# EAGLE design OSO-RING-B1-01 (EAGLE 9.6.2)
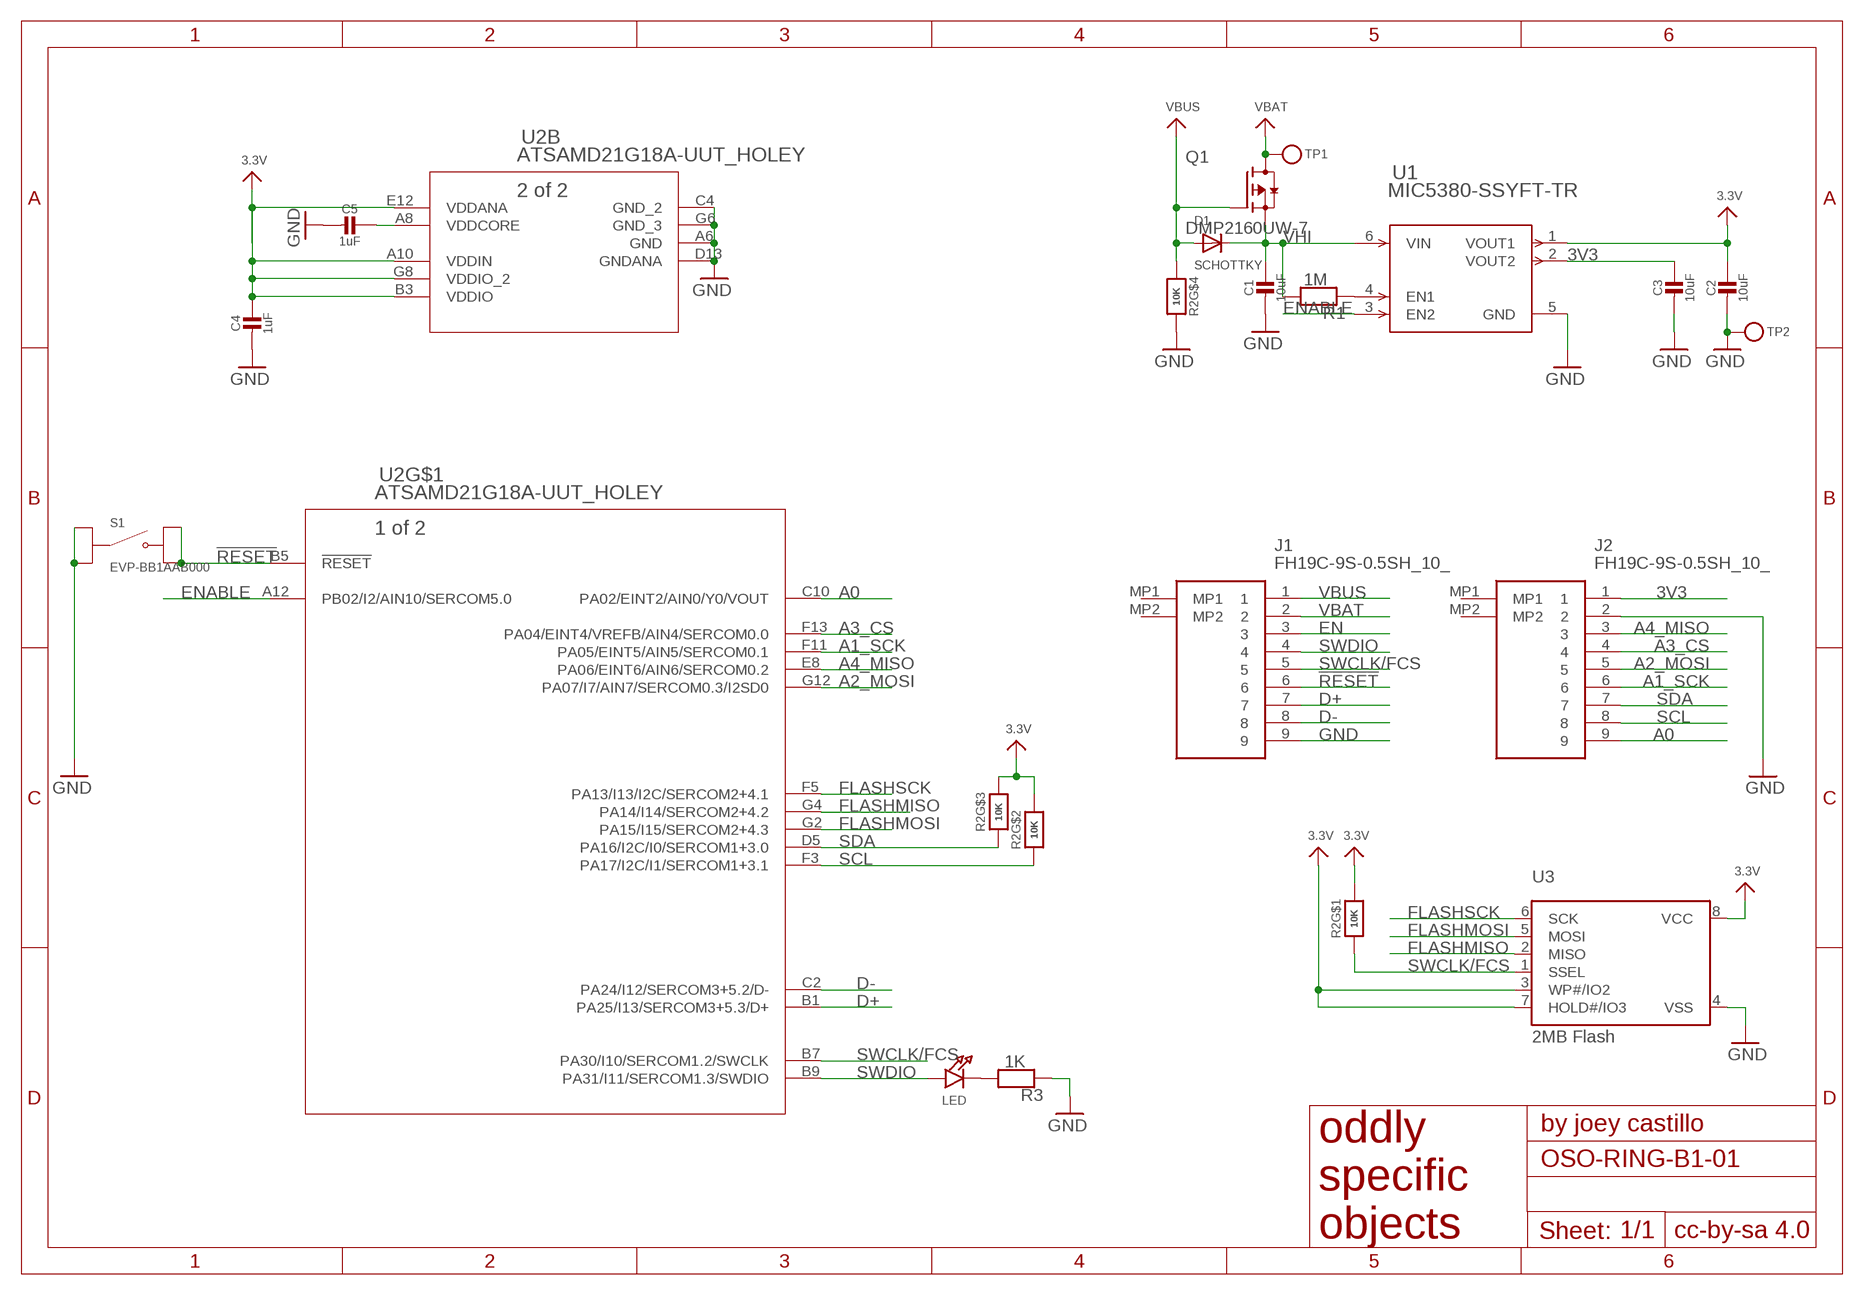
[diagram p0: schematic, sheet 1]

## Parts
C1  10uF  CAP_CERAMIC_0603MP  [_0603MP]
C2  10uF  CAP_CERAMIC_0603MP  [_0603MP]
C3  10uF  CAP_CERAMIC_0603MP  [_0603MP]
C4  1uF  CAP_CERAMIC_0603MP  [_0603MP]
C5  1uF  CAP_CERAMIC_0603MP  [_0603MP]
D1  SCHOTTKY  DIODESOD-323F  [SOD-323F]
J1  FH19C-9S-0.5SH_10_  [FH19C9S05SH10]
J2  FH19C-9S-0.5SH_10_  [FH19C9S05SH10]
LED  LED0603_NOOUTLINE  [CHIPLED_0603_NOOUTLINE]
Q1  DMP2160UW-7  [SOT65P210X110-3N]
R1  1M  RESISTOR_0603MP  [_0603MP]
R2  10K  EXB-V8V103JV-GOOD  [EXBV8V]
R3  1K  RESISTOR_0603MP  [_0603MP]
S1  EVP-BB1AAB000  [SW_EVP-BB1AAB000]
TP1  TESTPOINTROUND1.5MM  [TESTPOINT_ROUND_1.5MM]
TP2  TESTPOINTROUND1.5MM  [TESTPOINT_ROUND_1.5MM]
U1  MIC5380-SSYFT-TR  [TMLF-6_FT_MCH]
U2  ATSAMD21G18A-UUT_HOLEY  [WLCSP45_2P6X2P9_HOLEY]
U3  2MB Flash  SPIFLASH_8PINUX  [USON8]

## Nets
3.3V [power]: C2.1 C4.1 R2.6 R2.7 R2.8 U1.1(VOUT1) U2.A10(B:VDDIN) U2.B3(B:VDDIO) U2.E12(B:VDDANA) U2.G8(B:VDDIO_2) U3.3(WP#/IO2) U3.7(HOLD#/IO3) U3.8(VCC)
3V3 [power]: C3.1 J2.1 U1.2(VOUT2)
!RESET: J1.6 S1.B1 S1.B2 U2.B5(!RESET)
A0: J2.9 U2.C10(PA02/EINT2/AIN0/Y0/VOUT)
A1_SCK: J2.6 U2.F11(PA05/EINT5/AIN5/SERCOM0.1)
A2_MOSI: J2.5 U2.G12(PA07/I7/AIN7/SERCOM0.3/I2SD0)
A3_CS: J2.4 U2.F13(PA04/EINT4/VREFB/AIN4/SERCOM0.0)
A4_MISO: J2.3 U2.E8(PA06/EINT6/AIN6/SERCOM0.2)
D+: J1.7 U2.B1(PA25/I13/SERCOM3+5.3/D+)
D-: J1.8 U2.C2(PA24/I12/SERCOM3+5.2/D-)
EN: J1.3 R1.1 U1.4(EN1)
ENABLE: U1.3(EN2) U2.A12(PB02/I2/AIN10/SERCOM5.0)
FLASHMISO: U2.G4(PA14/I14/SERCOM2+4.2) U3.2(MISO)
FLASHMOSI: U2.G2(PA15/I15/SERCOM2+4.3) U3.5(MOSI)
FLASHSCK: U2.F5(PA13/I13/I2C/SERCOM2+4.1) U3.6(SCK)
GND [gnd]: C1.2 C2.2 C3.2 C4.2 C5.2 J1.9 J2.2 R2.5 R3.1 S1.A1 S1.A2 TP2.P$1 U1.5(GND) U2.A6(B:GND) U2.C4(B:GND_2) U2.D13(B:GNDANA) U2.G6(B:GND_3) U3.4(VSS)
N$1: LED.C R3.2
SCL: J2.8 R2.2 U2.F3(PA17/I2C/I1/SERCOM1+3.1)
SDA: J2.7 R2.3 U2.D5(PA16/I2C/I0/SERCOM1+3.0)
SWCLK/FCS: J1.5 R2.1 U2.B7(PA30/I10/SERCOM1.2/SWCLK) U3.1(SSEL)
SWDIO: J1.4 LED.A U2.B9(PA31/I11/SERCOM1.3/SWDIO)
VBAT [power]: J1.2 Q1.3(D) TP1.P$1
VBUS [power]: D1.A J1.1 Q1.1(G) R2.4
VDDCORE: C5.1 U2.A8(B:VDDCORE)
VHI [power]: C1.1 D1.C Q1.2(S) R1.2 U1.6(VIN)
Unconnected: J1.MP1 J1.MP2 J2.MP1 J2.MP2

## Library data of the parts
C1-C5 = microbuilder:CAP_CERAMIC: Ceramic Capacitors For new designs, use the packages preceded by an '_' character since they are more reliable: The following footprints should be used on most boards: _0402 - Standard footprint for regular board layouts _0603 - Standard footprint for regular board layouts _0805 - Standard footprint for regular board layouts _1206 - Standard footprint for regular board layouts For extremely tight-pitch boards where space is at a premium, the following 'micro-pitch' footprints can be used (smaller pads, no silkscreen outline, etc.): _0402MP - Micro-pitch footprint for very dense/compact boards _0603MP - Micro-pitch footprint for very dense/compact boards _0805MP - Micro-pitch footprint for very dense/compact boards _1206MP - Micro-pitch footprint for very dense/compact boards
D1 = adafruit:DIODE: Diode SMADIODE - SMA Surface Mount Package 20V 1A Schottky Diode Digikey: 641-1014-6-ND DO-1N4148 - Through Hole Small Current Diode SOD-123 20V 1 A (.5mV Vf) Schottky Diode - Digikey: MBRX120TPMSCT-ND SOD-323 10V 570mA (.38mV Vf, 3ns) Schottky Diode - Digikey: ZLLS410CT-ND SOD-523 30V 30mA Schottky Diode (RB751S-40TE61) - Digikey: RB751S-40TE61CT-ND SOT23-R/W - SOT23 Package (R = Solder Paste/Reflow Ovens, W = Hand-Soldering) BAT54Film 40V 300mA - Digikey: 497-7162-1-ND
J1 J2 = FH19C-9S-0.5SH:FH19C-9S-0.5SH_10_: CONN FFC BOTTOM 9POS 0.50MM R/A Source: Datasheet <https://componentsearchengine.com/Datasheets/1/FH19C-9S-0.5SH(10).pdf>; DESCRIPTION: CONN FFC BOTTOM 9POS 0.50MM R/A; HEIGHT: 1mm; MANUFACTURER_NAME: Hirose; MANUFACTURER_PART_NUMBER: FH19C-9S-0.5SH(10); MOUSER_PART_NUMBER: 798-FH19C9S05SH10; MOUSER_PRICE-STOCK: https://www.mouser.co.uk/ProductDetail/Hirose-Connector/FH19C-9S-05SH10?qs=vnk2wBG9e15bX8eK%2FvDSMA%3D%3D
LED = My Stuff:LED: LED 0603 - 0603 Surface Mount Package 2mA: Green LED - Low Power (3.9mcd, 2ma, 1.7Vf) - Digikey: 475-2709-2-ND Orange LED - Low Power (9.8mcd, 2ma, 1.8Vf) - Digikey: 475-1194-2-ND Red LED - Low Power (5mcd, 2ma, 1.8Vf) - Digikey: 475-1195-2-ND Yellow LED - Low Power (7mcd, 2ma, 1.8Vf) - Digikey: 475-1196-2-ND 5mA: Blue LED - Low Power (17mcd, 5ma, 2.9Vf) - Digikey: LNJ937W8CRACT-ND 0805 - 0805 Surface Mount Package 2mA: Red LED (8.8mcd, 2mA, 1.8Vf, Clear) - Low Power [Digikey: 475-2510-1-ND] Green LED (5mcd, 2mA, 1.8Vf, Clear) - Low Power [Digikey: 475-2730-1-ND] Yellow LED (11.3mcd, 2mA, 1.8Vf, Clear) - Low Power [Digikey: 475-2555-1-ND] 20mA: Red LED (104mcd, 20mA, Diffused) - LS R976 [Digikey: 475-1278-6-ND] Red LED (12mcd, 20mA, 2.0Vf, Clear) - APT2012EC [Digikey: 754-1128-1-ND] Green LED (15mcd, 20mA, 2.2Vf, Clear) - APT2012GC [Digikey: 754-1131-1-ND] Orange LED (160mcd, 20mA, 2.1Vf, Clear) - APT2012SECK [Digikey: 754-1130-1-ND] 1206 - 1206 Surface Mount Package Green LED (26mcd, 20mA, Diffused) - LG N971 [Digikey: 475-1407-6-ND] Red LED (15mcd, 20mA, Diffused) - LH N974 [Digikey: 475-1416-6-ND] Cree - Cree High-Power Surface Mount LEDs XPEBWT-L1-0000-00D50 - White 111lm 350mA 2.9Vf 6200K 110° XTEAWT-00-0000-00000LEE3 - White 114lm 350mA 2.85Vf 5000K 115° Everlight - Everlight 45-21 Series Surface Mount LEDs 45-21/QK2C-B2832AC2CB2/2T - Warm White 2000mcd 20mA 3.25Vf 3050K 120° 45-21/LK2C-B38452C4CB2/2T - Nuetral White 2000mcd 20mA 3.25Vf 4150K 120° 45-21/LK2C-B50634C6CB2/2T - Cold White 2200mcd 20mA 3.25Vf 5650K 120° PLCC2 Reverse Mount LS T77K-J1L2-1-0-2-R18-Z - Red 11.25mcd 2mA 1.8Vf 630nm 120° LO T77K-L1M2-24-Z - Orange 19.6mcd 2mA 1.8Vf 606nm 120° LY T77K-K2M1-26-Z - Yellow 15.7mcd 2mA 1.8Vf 587nm 120°
Q1 = DMP2160UW-7:DMP2160UW-7: DMP2160UW Series 20 V 100 mOhm P-Channel Enhancement Mode Mosfet - SOT-323; DESCRIPTION: P-Channel 20V 1.5A (Ta) 350mW (Ta) Surface Mount SOT-323; DIGI-KEY_PART_NUMBER: DMP2160UWDICT-ND; MF: Diodes Inc.; MP: DMP2160UW-7; PACKAGE: SOT-323 Diodes Inc.
R1 R3 = microbuilder:RESISTOR: Resistors For new designs, use the packages preceded by an '_' character since they are more reliable: The following footprints should be used on most boards: _0402 - Standard footprint for regular board layouts _0603 - Standard footprint for regular board layouts _0805 - Standard footprint for regular board layouts _1206 - Standard footprint for regular board layouts For extremely tight-pitch boards where space is at a premium, the following 'micro-pitch' footprints can be used (smaller pads, no silkscreen outline, etc.): _0402MP - Micro-pitch footprint for very dense/compact boards _0603MP - Micro-pitch footprint for very dense/compact boards _0805MP - Micro-pitch footprint for very dense/compact boards _1206MP - Micro-pitch footprint for very dense/compact boards
R2 = resistor array:EXB-V8V103JV-GOOD; MANUFACTURER_PART_NUMBER: EXBV8V103JV; VENDOR: Panasonic
S1 = EVP-BB1AAB000:EVP-BB1AAB000: SWITCH TACTILE SPST-NO 0.02A 15V; DESCRIPTION: Tactile Switch SPST-NO Top Actuated Surface Mount; DIGI-KEY_PART_NUMBER: P124390CT-ND; MF: Panasonic Electronic Components; MP: EVP-BB1AAB000; PACKAGE: None; PURCHASE-URL: https://pricing.snapeda.com/search/part/EVP-BB1AAB000/?ref=eda
TP1 TP2 = pygamer-microbuilder:TESTPOINT: Test Point Various test points for characterisation and PCB testing TESTPOINT_SMT - Compact Surface Mount Test Point [Digikey: 5016KTR-ND]
U1 = MIC5380SSYFTTR:MIC5380-SSYFT-TR; BUILT_BY: EMA_Jessica; COPYRIGHT: Copyright (C) 2018 Accelerated Designs. All rights reserved; MANUFACTURER_PART_NUMBER: MIC5380-SSYFT-TR; SOURCELIBRARY: Microchip_2019-08-23_3; VENDOR: Microchip
U2 = ATSAMD21G18A-UUT:ATSAMD21G18A-UUT_HOLEY
U3 = microbuilder:SPIFLASH_8PIN: SOIC8 SPI Flash Be careful with the size since SOIC8 flash comes in several 'widths' SOIC8 150 mil M25P16 - 16Mbit (2Mbit x 8) Serial Flash (75MHz SPI Bus), Supply: 2.7-3.6V Digikey: SOIC8 - M25P16-VMN6P-ND SOIC8 208 mil W25Q16BVSSIG - 16Mbit (2Mbit x 8) Serial Flash (104MHz SPI Bus), Supply: 2.7-3.6V Digikey: SOIC8 - W25Q16BVSSIG-ND

## Net classes
0 default: width 0.102 mm, drill 0.203 mm
1 power: width 0.203 mm, drill 0.203 mm
2 gnd: width 0.203 mm, drill 0.203 mm

## Board
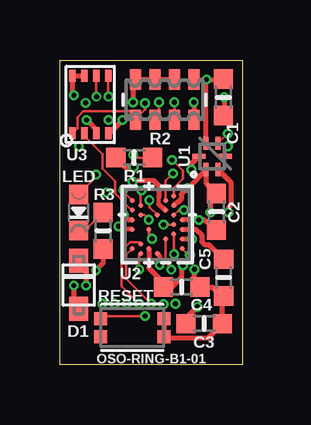
[diagram p1: board, top side]
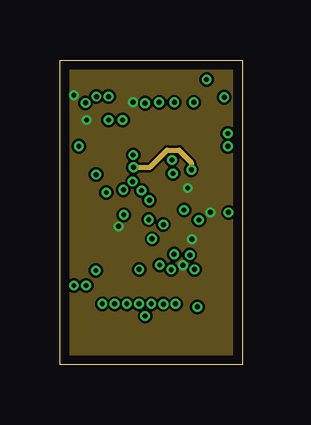
[diagram p2: board, inner layer Route2]
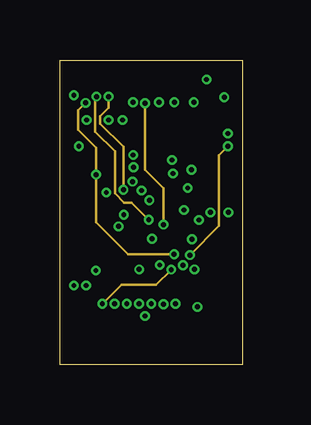
[diagram p3: board, inner layer Route3]
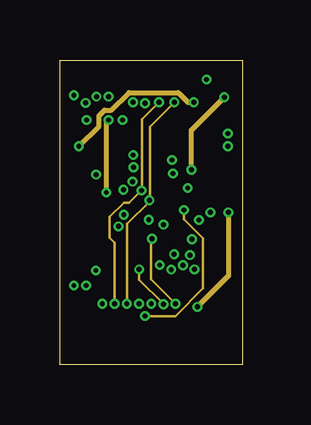
[diagram p4: board, inner layer Route14]
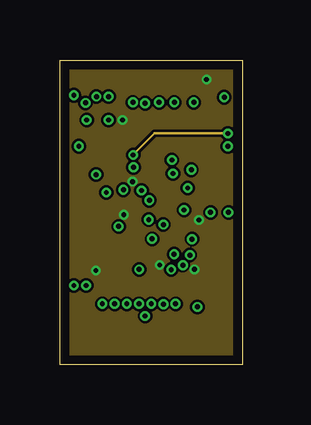
[diagram p5: board, inner layer Route15]
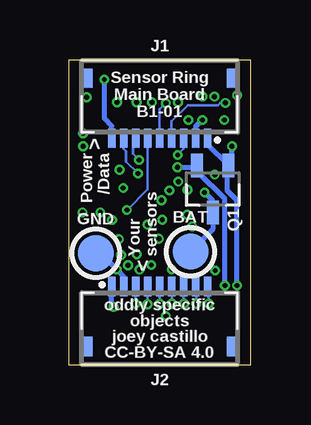
[diagram p6: board, bottom side, seen from below]

Size 7.62 x 12.7 mm. Coordinates in mm from the lower left corner, seen from the top.
Outline: 7.62,12.7 7.62,0 0,0 0,12.7 7.62,12.7
Copper layers (1+2*3+14*15+16): Top 0.04571875mm / dielectric 0.11074375mm / Route2 0.015240625mm / dielectric 4mil / Route3 0.015240625mm / dielectric 0.696975mm / Route14 0.015240625mm / dielectric 4mil / Route15 0.015240625mm / dielectric 0.11074375mm / Bottom 0.04571875mm
Design rules "oshpark-6layer-tentative": minimum track width 4mil, minimum drill 8mil, track to track 4mil, track to pad 4mil, pad to pad 4mil, via to via 4mil, smd to smd 4mil, copper to edge 15mil, drill to drill 6mil, minimum pad ring 4mil, minimum via ring 4mil, stop-mask expansion 1.5mil, vias tented up to drill 10mil, thermal gap 10mil

### Footprints (pad centres in the part's own frame; a part is rotated, then mirrored left to right if it is on the bottom)
_0603MP = smd 0.8 x 0.8: 1 -0.762,0; 2 0.762,0
SOD-323F = smd 1 x 0.8: A -1,0; C 1,0
FH19C9S05SH10 = smd 0.3 x 0.8: 1 -2,2.5; 2 -1.5,2.5; 3 -1,2.5; 4 -0.5,2.5; 5 0,2.5; 6 0.5,2.5; 7 1,2.5; 8 1.5,2.5; 9 2,2.5 | smd 0.4 x 0.8: MP1 -3,0; MP2 3,0
CHIPLED_0603_NOOUTLINE = smd 0.8 x 0.8: A 0,-0.75; C 0,0.75
SOT65P210X110-3N = smd 0.97 x 0.5: 1 -0.98,0.65; 2 -0.98,-0.65; 3 0.98,0
EXBV8V = smd 0.838 x 0.457: 1 -0.838,1.219; 2 -0.838,0.406; 3 -0.838,-0.406; 4 -0.838,-1.219; 5 0.838,-1.219; 6 0.838,-0.406; 7 0.838,0.406; 8 0.838,1.219
SW_EVP-BB1AAB000 = smd 0.55 x 0.55: A1 -1.325,0.375; A2 -1.325,-0.375; B1 1.325,0.375; B2 1.325,-0.375
TESTPOINT_ROUND_1.5MM = smd 1.5 x 1.5: P$1 0,0
TMLF-6_FT_MCH = smd 0.559 x 0.203: 1 -0.546,0.25; 2 -0.546,-0.25; 4 0.546,-0.25; 5 0.546,0.25 | smd 0.203 x 0.559: 3 0,-0.546; 6 0,0.546
WLCSP45_2P6X2P9_HOLEY = smd 0.203 x 0.203: A6 -0.2,1.04; A8 0.2,1.04; A10 0.6,1.04; A12 1,1.04; B1 -1.2,0.693; B3 -0.8,0.693; B5 -0.4,0.693; B7 0,0.693; B9 0.4,0.693; C2 -1,0.346; C4 -0.6,0.346; C10 0.6,0.346; D5 -0.4,0; D13 1.2,0; E8 0.2,-0.346; E12 1,-0.346; F3 -0.8,-0.693; F5 -0.4,-0.693; F11 0.8,-0.693; F13 1.2,-0.693; G2 -1,-1.04; G4 -0.6,-1.04; G6 -0.2,-1.04; G8 0.2,-1.04; G12 1,-1.04
USON8 = smd 0.5 x 0.275: 1 -1.2,0.75; 2 -1.2,0.25; 3 -1.2,-0.25; 4 -1.2,-0.75; 5 1.2,-0.75; 6 1.2,-0.25; 7 1.2,0.25; 8 1.2,0.75

### Placement (x,y rotation side)
C1  6.83,11.15 90 top
C2  6.53,6.38 270 top
C3  6.02,1.71 0 top
C4  5.08,3.24 0 top
C5  6.83,3.63 270 top
D1  0.79,3.33 90 top
J1  3.81,11.94 180 bottom
J2  3.81,0.76 0 bottom
LED  0.79,6.35 180 top
Q1  1.6,7.33 270 bottom
R1  3.1,8.64 180 top
R2  4.37,11.05 90 top
R3  1.8,5.59 90 top
S1  3.02,1.55 180 top
TP1  2.53,4.71 0 bottom
TP2  6.48,4.65 0 bottom
U1  6.35,8.69 90 top
U2  4.06,5.84 270 top
U3  1.27,10.85 90 top

### Tracks (layer width: path | path; a pad name or v marks a point on that pad's centre or on a via)
3.3V  (via drill 0.2)
  Top 0.203: U2.B3 4.87,6.76 4.92,6.76 5.07,6.91 5.07,7.1 v5.33,7.37 U1.1 6.1,7.56 C2.1 6.29,6.9 v6.29,6.35 | U2.A10 v5.51,5.24 | U3.3 1.52,9.82 1.24,10.1 1.22,10.1 v1.12,10.2 | U3.7 U3.8 0.52,11.3 v0.58,11.23 | R2.6 R2.7 R2.8 3.05,11.79 v3.05,10.93 | U2.G8 2.58,5.64 v2.45,5.77 | U2.E12 3.72,4.03 4.32,3.43 C4.1 4.66,3.24 5.08,3.66 5.08,4.1 v5.13,4.15
  pour Route2: -1.52,14.48 7.62,14.48 7.62,0 -1.52,0
3V3  (via drill 0.2)
  Top 0.203: U1.2 7,7.74 7.01,7.74 7.13,7.62 7.13,6.65 7.04,6.56 v7.04,6.35 | C3.1 5.26,1.93 v5.74,2.41
  Route14 0.203: v7.04,6.35 7.04,3.71 v5.74,2.41
  Bottom 0.203: v5.74,2.41 5.81,2.48 J2.1
!RESET  (via drill 0.2)
  Top 0.102: U2.B5 4.96,6.45 v5.18,6.45 | S1.B1 S1.B2 1.7,1.95 1.78,2.03 v3.56,2.03
  Route14 0.102: v3.56,2.03 4.82,2.03 5.97,3.18 5.97,5.28 5.18,6.07 v5.18,6.45
  Bottom 0.102: v5.18,6.45 4.31,7.32 J1.6
A0  (via drill 0.2)
  Top 0.102: U2.C10 4.41,4.43 4.52,4.32 4.52,4.09 v4.65,3.97
  Route3 0.102: v4.65,3.97 4.01,3.33 2.57,3.33 1.78,2.54 v1.77,2.54
  Bottom 0.102: v1.77,2.54 1.77,3.22 J2.9
A1_SCK  (via drill 0.2)
  Top 0.102: U2.F11 3.31,5.1 2.92,5.1 2.56,4.75 2.56,3.28 v3.3,2.54
  Bottom 0.102: v3.3,2.54 J2.6
A2_MOSI  (via drill 0.2)
  Top 0.102: U2.G12 2.77,4.59 2.77,3.58 v3.81,2.54
  Bottom 0.102: J2.5 v3.81,2.54
A3_CS  (via drill 0.2)
  Top 0.102: U2.F13 3.31,4.58 v3.31,3.97
  Route14 0.102: v4.32,2.53 v4.32,2.54 3.31,3.55 v3.31,3.97
  Bottom 0.102: J2.4 v4.31,2.53 v4.32,2.53
A4_MISO  (via drill 0.2)
  Top 0.102: U2.E8 3.72,5.38 v3.85,5.25
  Route14 0.102: v3.85,5.25 3.81,5.21 3.81,3.56 v4.83,2.54
  Bottom 0.102: v4.83,2.54 4.83,2.64 4.81,2.64 J2.3
D+  (via drill 0.2)
  Top 0.102: U2.B1 4.76,7.37 5.13,7.75 5.13,8.08 v4.67,8.53
  Bottom 0.102: v4.67,8.53 4.93,8.79 4.93,9 4.72,9.21 4.72,9.35 J1.7
D-  (via drill 0.2)
  Top 0.102: v4.72,7.97 4.41,7.66 U2.C2
  Bottom 0.102: v4.72,7.97 5.21,8.46 5.21,8.9 5.31,9.01 J1.8
EN  (via drill 0.2)
  Top 0.102: v3.06,8.74 3.17,8.64 R1.1 | U1.4 v7.01,9.64
  Route15 0.102: v3.06,8.74 3.95,9.64 v7.01,9.64
  Bottom 0.102: J1.3 2.81,8.99 v3.06,8.74
ENABLE  (via drill 0.2)
  Top 0.102: U2.A12 5.37,4.57 v5.42,4.57 | v7.01,9.1 6.9,8.99 U1.3
  Route3 0.102: v5.42,4.57 6.64,5.79 6.64,8.73 v7.01,9.1
FLASHMISO
  Top 0.102: U2.G4 3,6.44 2.29,7.15 2.29,7.66 1.78,8.17 1.78,8.78 1.02,9.54 U3.2
FLASHMOSI  (via drill 0.2)
  Top 0.102: U2.G2 2.65,7.22 v2.65,7.29 | v2.03,11.18 v2.02,11.19 U3.5
  Route3 0.102: v2.03,11.18 2.03,10.7 1.68,10.35 1.68,10.05 2.65,9.08 v2.65,7.29
FLASHSCK  (via drill 0.2)
  Top 0.102: U2.F5 3.51,6.24 v3.71,6.05 | v1.52,11.18 U3.6
  Route3 0.102: v3.71,6.05 2.99,6.76 2.68,6.76 2.29,7.15 2.29,8.89 1.47,9.71 1.47,11.12 v1.52,11.18
GND  (via drill 0.2)
  Top 0.168: 4.12,6.98 4.12,6.7
  Top 0.203: U2.D13 4.15,4.55 4.15,4.17 v4.17,4.16 | 4.12,6.7 4.38,6.44 U2.C4 | R2.5 6.1,11.89 | 6.1,11.89 v6.12,11.89 6.8,11.89 C1.2 | U2.G6 2.87,6.04 v2.67,6.25 | v5.61,3.97 5.61,3.47 C4.2 6.36,3.24 6.78,2.82 | C2.2 6.2,5.94 6.12,5.94 6.03,6.04 v5.8,6.04 U2.A6 | 6.78,2.82 C3.2 6.18,1.11 4.41,1.11 S1.A1 S1.A2 | 6.78,2.82 C5.2 | v3.04,7.63 3.07,7.67 3.94,7.67 4.14,7.47 4.14,7 4.12,6.98 | U3.4 2.06,9.65 v2.62,10.2 | U1.5 6.1,11.88 6.1,11.89 | R3.1 1.8,4.24 v1.5,3.93
  Bottom 0.203: J2.2 5.31,3.67 v5.61,3.97 6.29,4.65 TP2.P$1 | J1.9 5.81,9.95 6.12,10.26 v6.12,11.89
  pour Route15: -1.27,14.48 7.62,14.48 7.62,0 -1.27,0
N$1
  Top 0.102: LED.C 1.05,5.6 R3.2
SCL  (via drill 0.2)
  Top 0.102: U2.F3 3.37,7.23 v3.4,7.26 | v4.14,10.93 4.14,10.39 R2.2
  Route14 0.102: v4.14,10.93 3.43,10.22 3.43,7.29 v3.4,7.26 2.9,6.76 2.67,6.76 2.08,6.17 2.08,5.29 2.29,5.08 v2.29,2.54
  Bottom 0.102: v2.29,2.54 2.29,3.24 J2.8
SDA  (via drill 0.2)
  Top 0.102: U2.D5 3.73,6.57 v3.73,6.86 | v4.78,10.93 R2.3
  Route14 0.102: v4.78,10.93 3.76,9.92 3.76,6.88 v3.73,6.86 3.73,6.79 2.81,5.87 2.81,2.55 v2.79,2.54
  Bottom 0.102: v2.79,2.54 2.81,2.56 J2.7
SWCLK/FCS  (via drill 0.2)
  Top 0.102: v4.32,5.84 U2.B7 | U3.1 0.73,9.86 0.73,10.32 0.97,10.56 2.94,10.56 3.15,10.35 R2.1 3.56,10.62 v3.56,10.9
  Route3 0.102: v4.32,5.84 4.32,7.36 3.56,8.12 v3.56,10.9
  Bottom 0.102: v3.56,10.9 3.81,10.64 J1.5
SWDIO  (via drill 0.2)
  Top 0.102: U2.B9 v4.77,4.6 | v1.51,7.92 1.51,7.83 LED.A
  Route3 0.102: v4.77,4.6 2.84,4.6 1.51,5.94 v1.51,7.92 1.51,9.05 0.76,9.8 0.76,10.6 v1.07,10.91
  Bottom 0.102: J1.4 3.31,10.15 2.64,10.82 1.38,10.82 1.29,10.91 v1.07,10.91
VBAT  (via drill 0.2)
  Route14 0.203: v1.94,7.18 1.94,10.11 v2.03,10.2
  Bottom 0.203: v1.94,7.18 1.6,6.84 Q1.3 1.6,5.64 TP1.P$1 | v2.03,10.2 2.31,9.92 J1.2
VBUS  (via drill 0.2)
  Top 0.203: v5.59,10.93 R2.4 | D1.A 0.58,2.53 v0.58,3.3
  Route14 0.203: v0.79,9.1 1.63,9.94 1.63,10.37 1.86,10.61 2.15,10.61 2.88,11.34 4.94,11.34 5.35,10.93 v5.59,10.93
  Bottom 0.203: Q1.1 1.81,9.17 J1.1 | Q1.1 1,8.26 1,7.28 0.58,6.86 v0.58,3.3 | Q1.1 0.79,8.47 v0.79,9.1
VDDCORE
  Top 0.203: U2.A8 5.69,5.64 5.92,5.41 5.92,5.33 5.93,5.33 5.93,5.13 6.04,5.01 6.22,5.01 C5.1
VHI  (via drill 0.2)
  Top 0.203: U1.6 5.49,8.37 v5.49,8.13 | v6.86,11.15 6.86,10.42 C1.1 | R1.2 2.74,8.23 v3.07,8.23 | D1.C 1.09,4.02 v1.09,3.3
  Route2 0.203: v3.07,8.23 3.76,8.23 4.47,8.94 4.97,8.94 5.49,8.42 v5.49,8.13
  Route14 0.203: v5.49,8.13 5.49,9.78 v6.86,11.15
  Bottom 0.203: v3.07,8.23 2.33,8.23 Q1.2 2.25,8.07 1.09,6.91 v1.09,3.3

### Text on the board
tPlace: RESET | OSO-RING-B1-01
bPlace: Sensor Ring / Main Board / B1-01 | < | Power / /Data | BAT | GND | < | Your / sensors | oddly specific / objects / joey castillo / CC-BY-SA 4.0
tNames: U3